# EAGLE design controller (EAGLE 6.3)
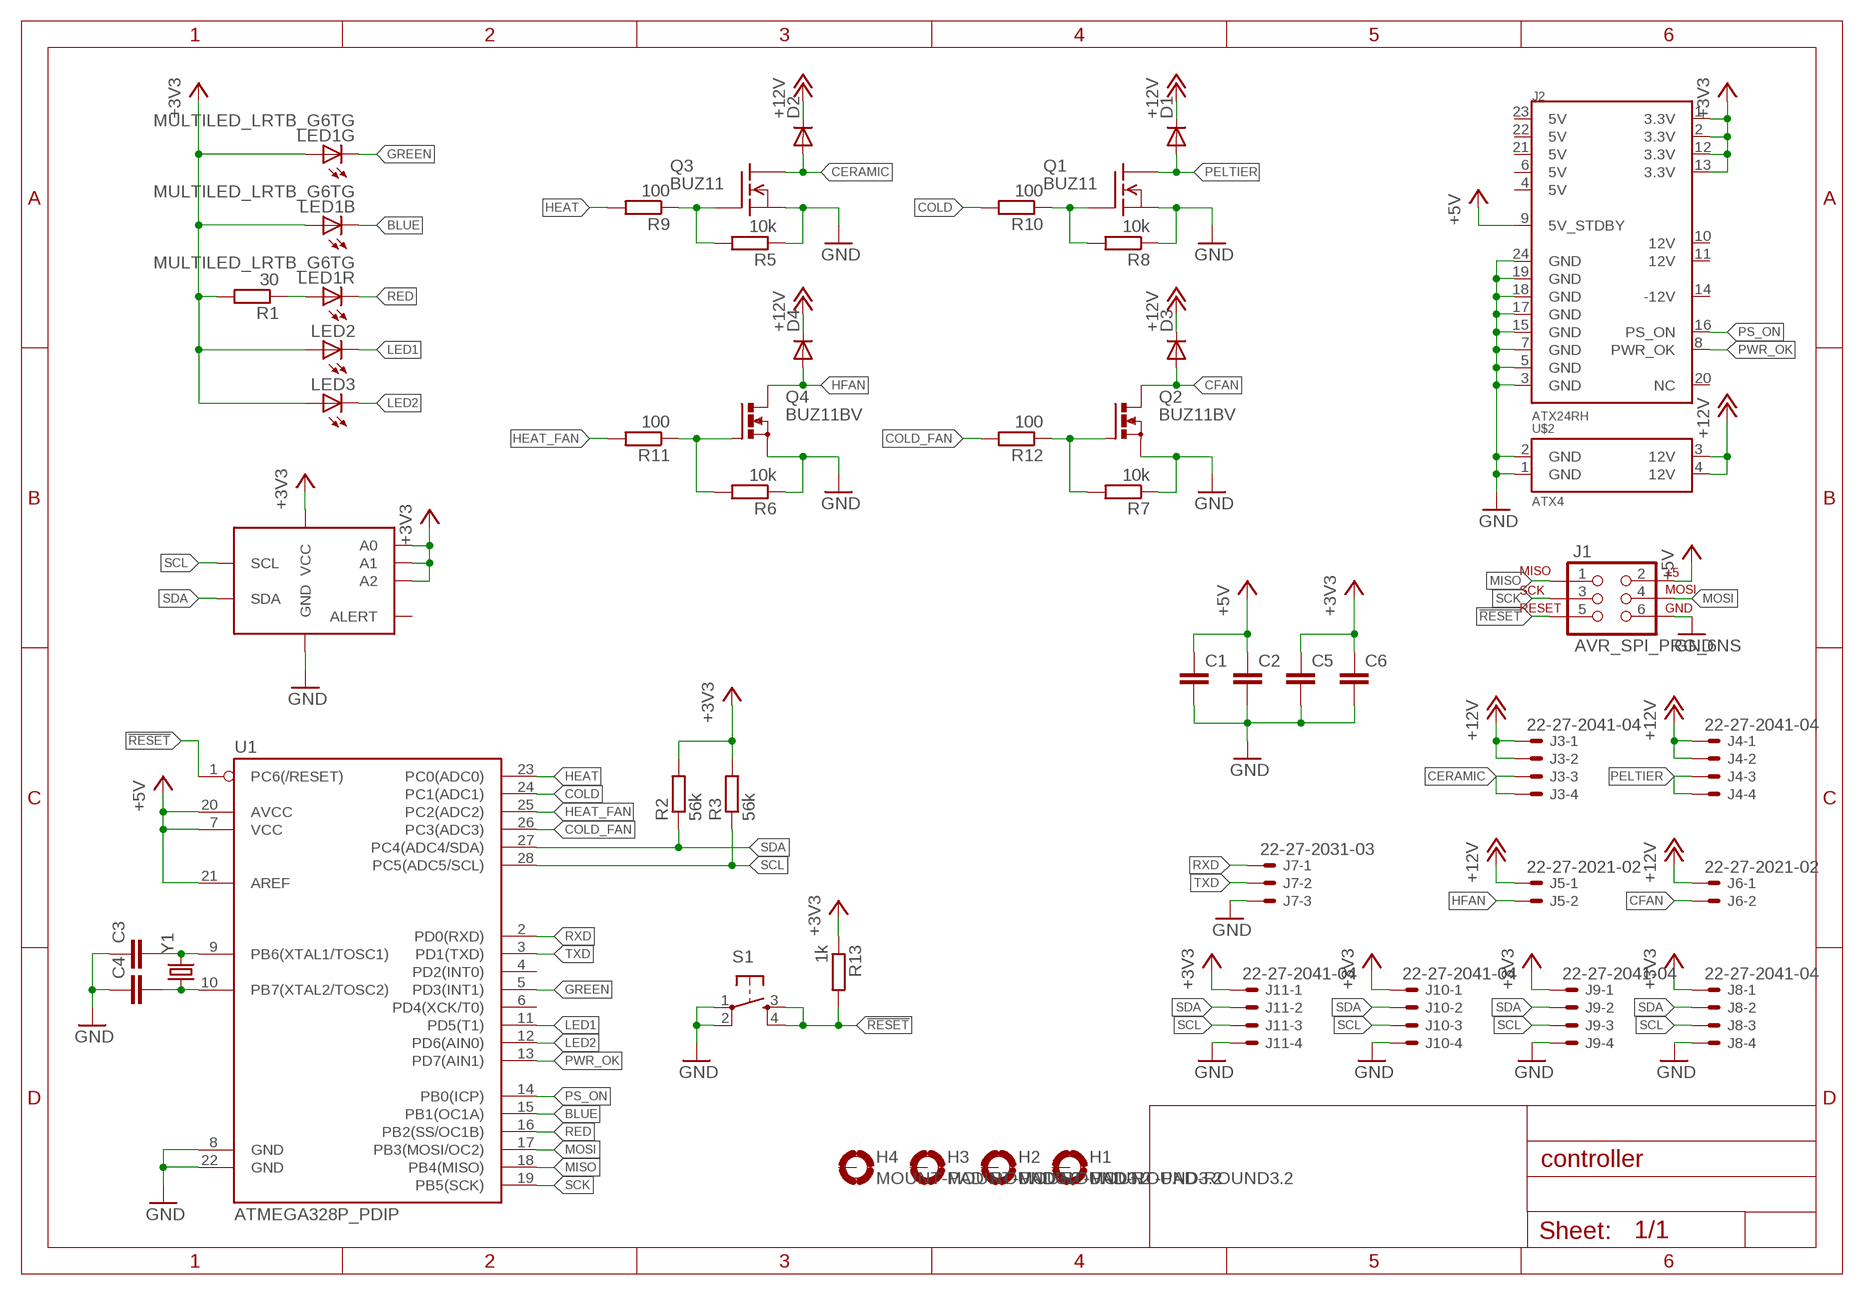
[diagram p0: schematic, sheet 1]

## Parts
C1  C-EUC0603  [C0603]
C2  C-EUC0603  [C0603]
C3  C-EUC0603K  [C0603K]
C4  C-EUC0603K  [C0603K]
C5  C-EUC0603  [C0603]
C6  C-EUC0603  [C0603]
D1  DIODE-DO201-15  [DO201-15]
D2  DIODE-DO201-15  [DO201-15]
D3  DIODE-DO201-15  [DO201-15]
D4  DIODE-DO201-15  [DO201-15]
H1  MOUNT-PAD-ROUND3.2  [3,2-PAD]
H2  MOUNT-PAD-ROUND3.2  [3,2-PAD]
H3  MOUNT-PAD-ROUND3.2  [3,2-PAD]
H4  MOUNT-PAD-ROUND3.2  [3,2-PAD]
J1  AVR_SPI_PRG_6NS  [2X3-NS]
J2  ATX24RH  [ATX24_RIGHT_ANGLE]
J3  22-27-2041-04  [6410-04]
J4  22-27-2041-04  [6410-04]
J5  22-27-2021-02  [6410-02]
J6  22-27-2021-02  [6410-02]
J7  22-27-2031-03  [6410-03]
J8  22-27-2041-04  [6410-04]
J9  22-27-2041-04  [6410-04]
J10  22-27-2041-04  [6410-04]
J11  22-27-2041-04  [6410-04]
LED1  MULTILED_LRTB_G6TG  [P-LCC-6_TOPLED]
LED2  LEDSML1206  [SML1206]
LED3  LEDSML1206  [SML1206]
Q1  BUZ11  [TO220]
Q2  BUZ11BV  [TO220BV]
Q3  BUZ11  [TO220]
Q4  BUZ11BV  [TO220BV]
R1  30  R-EU_R0603  [R0603]
R2  56k  R-EU_R0603  [R0603]
R3  56k  R-EU_R0603  [R0603]
R5  10k  R-EU_R0603  [R0603]
R6  10k  R-EU_R0603  [R0603]
R7  10k  R-EU_R0603  [R0603]
R8  10k  R-EU_R0603  [R0603]
R9  100  R-EU_R0603  [R0603]
R10  100  R-EU_R0603  [R0603]
R11  100  R-EU_R0603  [R0603]
R12  100  R-EU_R0603  [R0603]
R13  1k  R-EU_R0603  [R0603]
S1  TAC_SWITCHPTH  [TACTILE-PTH]
U1  ATMEGA328P_PDIP  [DIL28-3]
U$1  TMP175  [MSOP8]
U$2  ATX4  [ATX4]
Y1  CRYSTALHC49UV  [HC49U-V]

## Nets
!RESET: J1.5 R13.2 S1.3 S1.4 U1.1(PC6(/RESET))
+3V3: C5.1 C6.1 J2.1(3.3V) J2.2(3.3V) J2.12(3.3V) J2.13(3.3V) J8.1 J9.1 J10.1 J11.1 LED1.A2(G:A) LED1.A3(B:A) LED2.A LED3.A R1.2 R2.2 R3.2 R13.1 U$1.5(A2) U$1.6(A1) U$1.7(A0) U$1.8(VCC)
+5V: C1.1 C2.1 J1.2 J2.9(5V_STDBY) U1.7(VCC) U1.20(AVCC) U1.21(AREF)
+12V: D1.C D2.C D3.C D4.C J3.1 J3.2 J4.1 J4.2 J5.1 J6.1 U$2.3(12V) U$2.4(12V)
BLUE: LED1.C3(B:C) U1.15(PB1(OC1A))
CERAMIC: D2.A J3.3 J3.4 Q3.2(D)
CFAN: D3.A J6.2 Q2.D
COLD: R10.2 U1.24(PC1(ADC1))
COLD_FAN: R12.2 U1.26(PC3(ADC3))
GND: C1.2 C2.2 C3.1 C4.1 C5.2 C6.2 J1.6 J2.3(GND) J2.5(GND) J2.7(GND) J2.15(GND) J2.17(GND) J2.18(GND) J2.19(GND) J2.24(GND) J7.3 J8.4 J9.4 J10.4 J11.4 Q1.3(S) Q2.S Q3.3(S) Q4.S R5.1 R6.1 R7.1 R8.1 S1.1 S1.2 U1.8(GND) U1.22(GND) U$1.4(GND) U$2.1(GND) U$2.2(GND)
GREEN: LED1.C2(G:C) U1.5(PD3(INT1))
HEAT: R9.2 U1.23(PC0(ADC0))
HEAT_FAN: R11.2 U1.25(PC2(ADC2))
HFAN: D4.A J5.2 Q4.D
LED1: LED2.C U1.11(PD5(T1))
LED2: LED3.C U1.12(PD6(AIN0))
MISO: J1.1 U1.18(PB4(MISO))
MOSI: J1.4 U1.17(PB3(MOSI/OC2))
N$1: C3.2 U1.9(PB6(XTAL1/TOSC1)) Y1.2
N$2: C4.2 U1.10(PB7(XTAL2/TOSC2)) Y1.1
N$3: LED1.A1(R:A) R1.1
N$4: Q2.G R7.2 R12.1
N$5: Q4.G R6.2 R11.1
N$9: Q1.1(G) R8.2 R10.1
N$10: Q3.1(G) R5.2 R9.1
PELTIER: D1.A J4.3 J4.4 Q1.2(D)
PS_ON: J2.16(PS_ON) U1.14(PB0(ICP))
PWR_OK: J2.8(PWR_OK) U1.13(PD7(AIN1))
RED: LED1.C1(R:C) U1.16(PB2(SS/OC1B))
RXD: J7.1 U1.2(PD0(RXD))
SCK: J1.3 U1.19(PB5(SCK))
SCL: J8.3 J9.3 J10.3 J11.3 R3.1 U1.28(PC5(ADC5/SCL)) U$1.2(SCL)
SDA: J8.2 J9.2 J10.2 J11.2 R2.1 U1.27(PC4(ADC4/SDA)) U$1.1(SDA)
TXD: J7.2 U1.3(PD1(TXD))
Unconnected: H1.B3,2(MOUNT) H2.B3,2(MOUNT) H3.B3,2(MOUNT) H4.B3,2(MOUNT) J2.4(5V) J2.6(5V) J2.10(12V) J2.11(12V) J2.14(-12V) J2.20(NC) J2.21(5V) J2.22(5V) J2.23(5V) U1.4(PD2(INT0)) U1.6(PD4(XCK/T0)) U$1.3(ALERT)

## Library data of the parts
C1-C6 = rcl:C-EU: CAPACITOR, European symbol
D1-D4 = diode:DIODE-: DIODE
H1-H4 = holes:MOUNT-PAD-ROUND: MOUNTING PAD, round
J1 = SparkFun-Connectors:AVR_SPI_PRG_6: AVR ISP 6 Pin This is the reduced ISP connector for AVR programming. Common on Arduino. This footprint will take up less PCB space and can be used with a 10-pin to 6-pin adapter such as SKU: BOB-08508
J2 = hauser:ATX24: ATX24 Pin Power Supply Connector This is a good connector for connecting a computer power supply to a PCB. It's massive, but provides many amps of power at 5V and 12V. SKU: PRT-09498
J3 J4 J8-J11 = con-molex:22-?-04: CONNECTOR wire to board 2.54 mm (.1 inch) pitch header; OC_FARNELL: unknown; OC_NEWARK: unknown
J5 J6 = con-molex:22-?-02: CONNECTOR wire to board 2.54 mm (.1 inch) pitch header; OC_FARNELL: unknown; OC_NEWARK: unknown
J7 = con-molex:22-?-03: CONNECTOR wire to board 2.54 mm (.1 inch) pitch header; OC_FARNELL: unknown; OC_NEWARK: unknown
LED1 = hauser:MULTILED_LRTB_G6TG: 6-lead MULTILED® Enhanced optical Power LED (ThinFilm® / ThinGaN®) Source. OSRAM - LRTB_G6TG.pdf
LED2 LED3 = hauser:LED: LED OSRAM: - CHIPLED LG R971, LG N971, LY N971, LG Q971, LY Q971, LO R971, LY R971 LH N974, LH R974 LS Q976, LO Q976, LY Q976 LO Q996 - Hyper CHIPLED LW Q18S LB Q993, LB Q99A, LB R99A - SideLED LS A670, LO A670, LY A670, LG A670, LP A670 LB A673, LV A673, LT A673, LW A673 LH A674 LY A675 LS A676, LA A676, LO A676, LY A676, LW A676 LS A679, LY A679, LG A679 - Hyper Micro SIDELED® LS Y876, LA Y876, LO Y876, LY Y876 LT Y87S - SmartLED LW L88C, LW L88S LB L89C, LB L89S, LG L890 LS L89K, LO L89K, LY L89K LS L896, LA L896, LO L896, LY L896 - TOPLED LS T670, LO T670, LY T670, LG T670, LP T670 LSG T670, LSP T670, LSY T670, LOP T670, LYG T670 LG T671, LOG T671, LSG T671 LB T673, LV T673, LT T673, LW T673 LH T674 LS T676, LA T676, LO T676, LY T676, LB T676, LH T676, LSB T676, LW T676 LB T67C, LV T67C, LT T67C, LS T67K, LO T67K, LY T67K, LW E67C LS E67B, LA E67B, LO E67B, LY E67B, LB E67C, LV E67C, LT E67C LW T67C LS T679, LY T679, LG T679 LS T770, LO T770, LY T770, LG T770, LP T770 LB T773, LV T773, LT T773, LW T773 LH T774 LS E675, LA E675, LY E675, LS T675 LS T776, LA T776, LO T776, LY T776, LB T776 LHGB T686 LT T68C, LB T68C - Hyper Mini TOPLED® LB M676 - Mini TOPLED Santana® LG M470 LS M47K, LO M47K, LY M47K Source: http://www.osram.convergy.de LUXEON: - LUMILED® LXK2-PW12-R00, LXK2-PW12-S00, LXK2-PW14-U00, LXK2-PW14-V00 LXK2-PM12-R00, LXK2-PM12-S00, LXK2-PM14-U00 LXK2-PE12-Q00, LXK2-PE12-R00, LXK2-PE12-S00, LXK2-PE14-T00, LXK2-PE14-U00 LXK2-PB12-K00, LXK2-PB12-L00, LXK2-PB12-M00, LXK2-PB14-N00, LXK2-PB14-P00, LXK2-PB14-Q00 LXK2-PR12-L00, LXK2-PR12-M00, LXK2-PR14-Q00, LXK2-PR14-R00 LXK2-PD12-Q00, LXK2-PD12-R00, LXK2-PD12-S00 LXK2-PH12-R00, LXK2-PH12-S00 LXK2-PL12-P00, LXK2-PL12-Q00, LXK2-PL12-R00 Source: www.luxeon.com KINGBRIGHT: KA-3528ASYC Source: www.kingbright.com
Q1 Q3 = transistor-fet:BUZ11: N-Channel Enhancement MOSFET 50V; 30A; 0,040Ohm
Q2 Q4 = transistor-power:BUZ11: N-CHANNEL MOS FET
R1-R3 R5-R13 = rcl:R-EU_: RESISTOR, European symbol
S1 = SparkFun-Electromechanical:TAC_SWITCH: Momentary Switch Button commonly used for reset or general input. Spark Fun Electronics SKU : COM-00097 SMT- SWCH-08247
U1 = SparkFun-DigitalIC:ATMEGA328P_PDIP: uC used in the Arduino 32kb flash, 1k EEPROM, 2k SRAM This is the through-hole version of this chip.
U$1 = hauser:TMP175
U$2 = hauser:ATX4
Y1 = SparkFun-FreqCtrl:CRYSTAL: Various standard crystals. Proven footprints. Spark Fun Electronics SKU : COM-00534

## Board
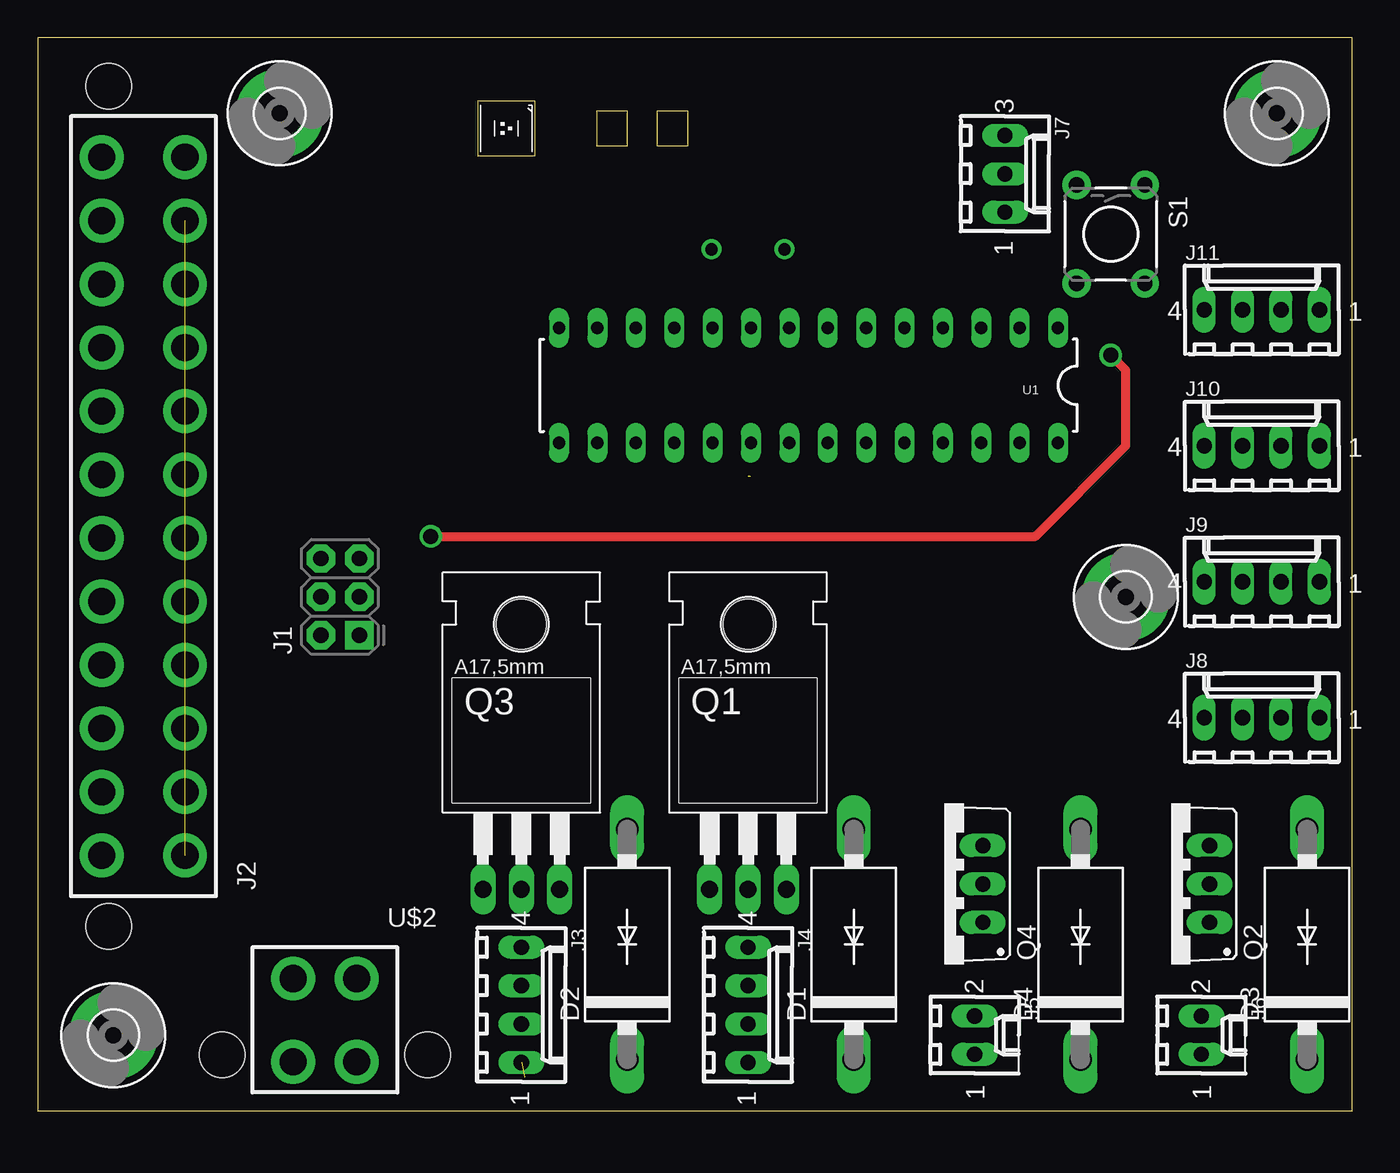
[diagram p1: board, top side]
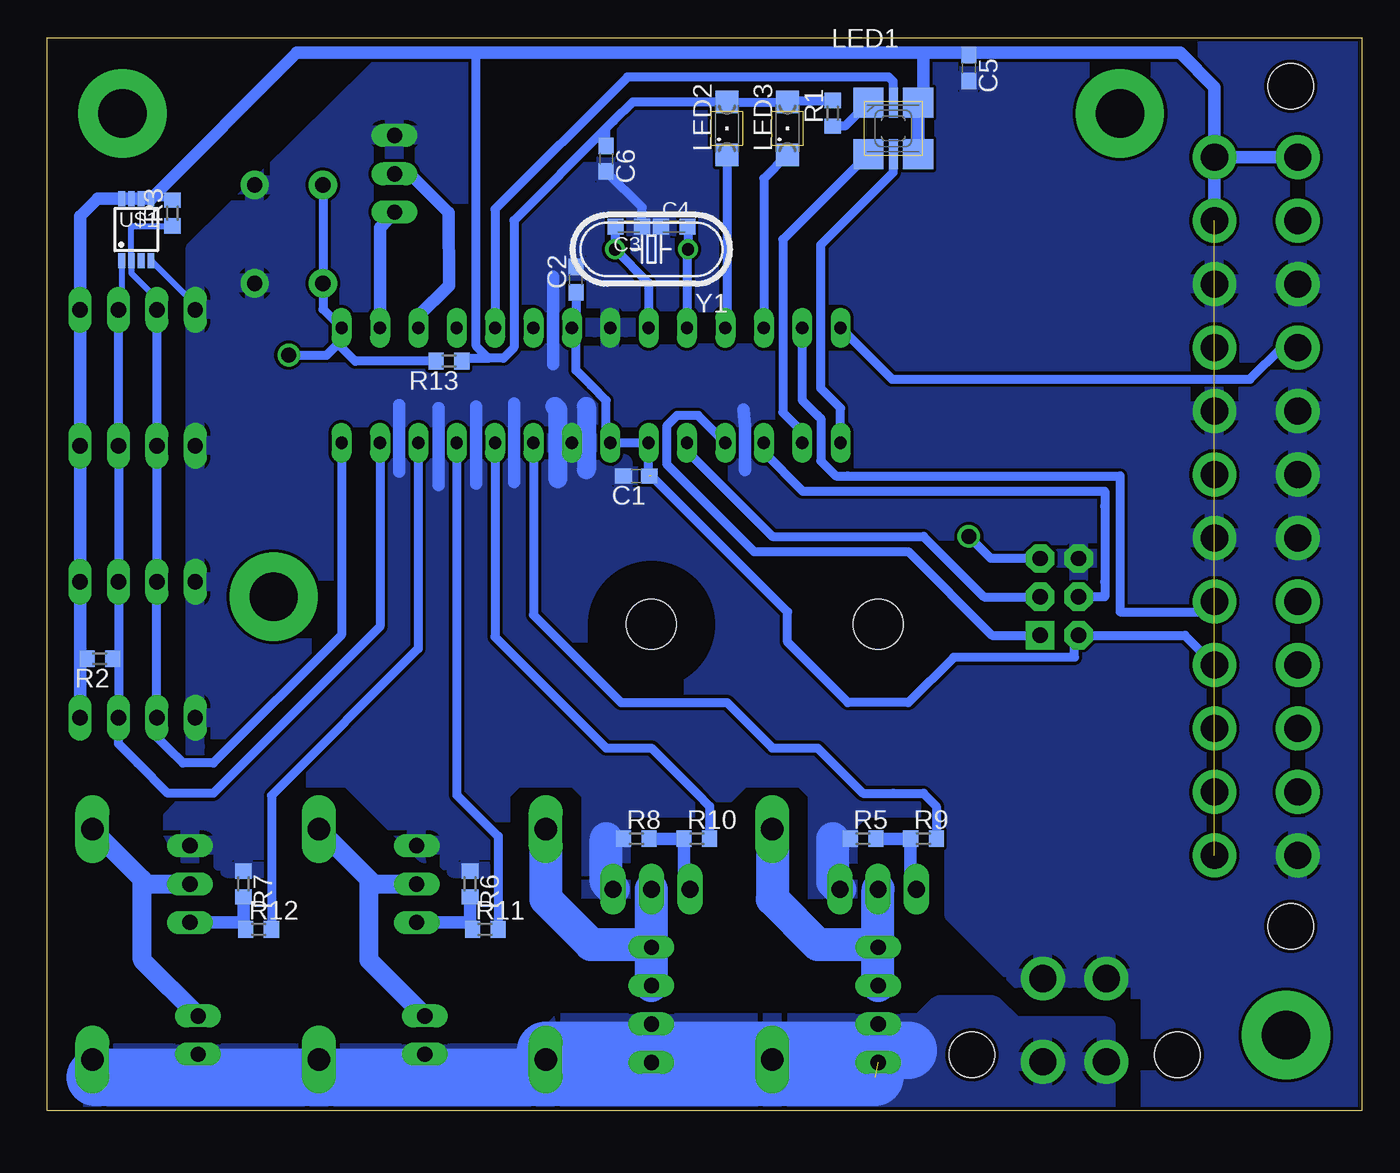
[diagram p2: board, bottom side, seen from below]

Size 87 x 71 mm. Coordinates in mm from the lower left corner, seen from the top.
Outline: 0,0 87,0 87,71 0,71 0,0
Copper layers (1*16): Top 0.035mm / dielectric 1.5mm / Bottom 0.035mm
Design rules "default *": minimum track width 10mil, minimum drill 24mil, track to track 8mil, track to pad 8mil, pad to pad 8mil, via to via 8mil, smd to smd 8mil, copper to edge 10mil, drill to drill 8mil, minimum pad ring 10mil, minimum via ring 8mil, stop-mask expansion 4mil, vias tented up to drill 0mil, thermal gap 10mil

### Footprints (pad centres in the part's own frame; a part is rotated, then mirrored left to right if it is on the bottom)
C0603 = smd 1.1 x 1: 1 -0.85,0; 2 0.85,0
C0603K = smd 1.05 x 1.08: 1 -0.875,0; 2 0.875,0
DO201-15 = drill 1.499 long: A 7.62,0; C -7.62,0
3,2-PAD = drill 3.2 pad 5.842: B3,2 0,0
2X3-NS = drill 1.016 pad 1.88 square: 1 -2.54,-1.27 | drill 1.016 pad 1.88 octagon: 2 -2.54,1.27; 3 0,-1.27; 4 0,1.27; 5 2.54,-1.27; 6 2.54,1.27
ATX24_RIGHT_ANGLE = drill 1.8 pad 2.9: 1 23.1,-2.74; 2 18.9,-2.74; 3 14.7,-2.74; 4 10.5,-2.74; 5 6.3,-2.74; 6 2.1,-2.74; 7 -2.1,-2.74; 8 -6.3,-2.74; 9 -10.5,-2.74; 10 -14.7,-2.74; 11 -18.9,-2.74; 12 -23.1,-2.74; 13 23.1,2.76; 14 18.9,2.76; 15 14.7,2.76; 16 10.5,2.76; 17 6.3,2.76; 18 2.1,2.76; 19 -2.1,2.76; 20 -6.3,2.76; 21 -10.5,2.76; 22 -14.7,2.76; 23 -18.9,2.76; 24 -23.1,2.76 | hole 3: -27.8,2.3; 27.8,2.3
6410-04 = drill 1.016 long: 1 3.81,0; 2 1.27,0; 3 -1.27,0; 4 -3.81,0
6410-02 = drill 1.016 long: 1 1.27,0; 2 -1.27,0
6410-03 = drill 1.016 long: 1 2.54,0; 2 0,0; 3 -2.54,0
P-LCC-6_TOPLED = smd 2 x 2: A1 -1.65,1.7; A2 1.65,1.7; A3 1.65,-1.7; C1 -1.65,-1.7 | smd 0.6 x 2: C2 0,1.7; C3 0,-1.7
SML1206 = smd 1.5 x 1.5: A 1.75,0; C -1.75,0
TO220 = drill 1.118 long: 1 -2.54,-6.35; 2 0,-6.35; 3 2.54,-6.35 | hole 3.302: 0,11.176
TO220BV = drill 1.016 long: D 0,-2.54; G -2.54,-2.54; S 2.54,-2.54
R0603 = smd 1 x 1.1: 1 -0.85,0; 2 0.85,0
TACTILE-PTH = drill 1.016 pad 1.88: 1 -3.251,2.261; 2 3.251,2.261; 3 -3.251,-2.261; 4 3.251,-2.261
DIL28-3 = drill 0.813 long: 1 -16.51,-3.81; 2 -13.97,-3.81; 3 -11.43,-3.81; 4 -8.89,-3.81; 5 -6.35,-3.81; 6 -3.81,-3.81; 7 -1.27,-3.81; 8 1.27,-3.81; 9 3.81,-3.81; 10 6.35,-3.81; 11 8.89,-3.81; 12 11.43,-3.81; 13 13.97,-3.81; 14 16.51,-3.81; 15 16.51,3.81; 16 13.97,3.81; 17 11.43,3.81; 18 8.89,3.81; 19 6.35,3.81; 20 3.81,3.81; 21 1.27,3.81; 22 -1.27,3.81; 23 -3.81,3.81; 24 -6.35,3.81; 25 -8.89,3.81; 26 -11.43,3.81; 27 -13.97,3.81; 28 -16.51,3.81
MSOP8 = smd 0.45 x 1: 1 -0.975,-2.05; 2 -0.325,-2.05; 3 0.325,-2.05; 4 0.975,-2.05; 5 0.975,2.05; 6 0.325,2.05; 7 -0.325,2.05; 8 -0.975,2.05
ATX4 = drill 1.8 pad 2.9: 1 2.1,-2.74; 2 -2.1,-2.74; 3 2.1,2.76; 4 -2.1,2.76 | hole 3: -6.8,2.3; 6.8,2.3
HC49U-V = drill 0.813: 1 -2.413,0; 2 2.413,0

### Placement (x,y rotation side)
C1  48,42 180 bottom
C2  52,55 90 bottom
C3  48.5,58.5 180 bottom
C4  45.5,58.5 0 bottom
C5  26,69 270 bottom
C6  50,63 270 bottom
D1  54,11 90 top
D2  39,11 90 top
D3  84,11 90 top
D4  69,11 90 top
H1  5,5 0 top
H2  72,34 0 top
H3  82,66 0 top
H4  16,66 0 top
J1  20,34 90 top
J2  7,40 90 top
J3  32,7 270 top
J4  47,7 270 top
J5  62,5 270 top
J6  77,5 270 top
J7  64,62 270 top
J8  81,26 0 top
J9  81,35 0 top
J10  81,44 0 top
J11  81,53 0 top
LED1  31,65 0 bottom
LED2  42,65 90 bottom
LED3  38,65 90 bottom
Q1  47,21 0 top
Q2  75,15 90 top
Q3  32,21 0 top
Q4  60,15 90 top
R1  35,66 90 bottom
R2  83.5,29.9 180 bottom
R3  78.7,59.4 90 bottom
R5  33,18 0 bottom
R6  59,15 270 bottom
R7  74,15 270 bottom
R8  48,18 0 bottom
R9  29,18 0 bottom
R10  44,18 0 bottom
R11  58,12 0 bottom
R12  73,12 0 bottom
R13  60.4,49.6 180 bottom
S1  71,58 270 top
U1  51,48 180 top
U$1  81.09,58.31 0 bottom
U$2  19,6 180 top
Y1  47,57 180 bottom

### Tracks (layer width: path | path; a pad name or v marks a point on that pad's centre or on a via)
!RESET  (via drill 1 pad 1.27)
  Top 0.61: v26,38 66,38 72,44 72,49 v71,50
  Bottom 0.61: R13.2 66.6,49.6 67.51,50.51 67.51,51 | J1.5 24.54,36.54 v26,38 | v71,50 69.32,50 68.51,50 67.51,51 | S1.3 S1.4 68.74,53.04 U1.1 67.51,51
+3V3  (1 unrouted)
  Bottom 0.406: R3.2 79.1,60.36 U$1.5
  Bottom 0.61: R2.2 84.45,30 84.81,30 | R1.2 37.9,66.85 LED3.A LED2.A 48.25,66.75 49.5,65.5 | 49.5,65.5 50,65 | 50,65 56.1,58.9 56.1,50.5 56.8,49.8 57.8,49.8 | 57.8,49.8 58.6,50.6 58.6,70 | C6.1 50,65 | 50,65 49.5,65.5 | C5.1 26,70 | R13.1 59.55,49.8 57.8,49.8
  Bottom 0.813: J10.1 J9.1 84.81,30 J8.1 | J2.13 J2.1 | J2.1 J2.2 | J10.1 | J10.1 J11.1 84.81,59.19 83.64,60.36 U$1.8 U$1.7 U$1.6 U$1.5 70.47,70 58.6,70 29,70 | J2.1 9.74,67.74 12,70 26,70 26.05,70 29,70 | LED1.A3 LED1.A2 29,67.05 29,70
+5V  (1 unrouted)
  Bottom 0.61: C2.1 52,52.08 U1.7 52,51.54 52,49 51,48 50,47 50,44.46 U1.21 U1.20 47.19,42.19 47,42 38,33 38,31 34,27 30,27 27,30 19,30 19,31.19 J1.2 11.7,31.46 J2.9
+12V  (1 unrouted)
  Bottom 3.81: 32.2,2.2 83.8,2.2 | 30,4 54,4 54,3
  pour Bottom: 16.9,5.6 23,5.6 24.4,7 28,7 29.2,5.8 53,5.8 55,3.8 84,3.8 84,0 16.9,0
BLUE
  Bottom 0.61: U1.15 34.49,46.49 35.8,47.8 35.8,57.3 31,62.1 LED1.C3
CERAMIC
  Bottom 2.184: D2.A 39,14 36,11 32.19,11 J3.4 | J3.3 J3.4 | J3.4 Q3.2
CFAN
  Bottom 1.27: D3.A 80.69,15.31 | 80.69,15.31 80.38,15 Q2.D | J6.2 80.69,9.96 80.69,15.31
COLD
  Bottom 0.61: U1.24 57.35,31.35 50,24 47,24 44,21 43.15,20.15 R10.2
COLD_FAN
  Bottom 0.61: U1.26 62.43,30.57 72,21 72.15,20.85 R12.2
GND
  Bottom 0.406: U$1.4 77.19,53.34 J11.4
  Bottom 0.61: C3.1 47.62,59.77 C6.2
  Bottom 0.813: 56.1,41.6 56.1,46.8 | 58.6,41.5 58.6,46.6 | 61.1,41.4 61.1,46.5 | 63.7,42.3 63.7,46.7 | 53.5,55.2 53.5,49.4 | 40.9,46.4 40.8,45.3 40.8,42.4
  Bottom 1.27: 51.3,46.6 51.3,42.4 | 53.4,46.6 53.2,46.4 53.2,41.8
  Bottom 2.184: Q1.3 50,15.11 50,18 | Q3.3 35,15.11 35,18
  pour Bottom: 0,0 14,0 14,8 22,8 27,13 27,20 33,20 34,19 34,14 36,14 36,21 37,22 41,22 43,20 49,20 49,14 51,14 51,21 52,22 56,22 57,21 57,17 58,16 60,16 61,17 62,17 67,22 71,22 72,21 72,16 75,16 76,17 78,17 79,19 77.2,21 77.2,57 63,71 0,71
GREEN
  Bottom 0.61: LED1.C2 31,68.1 31.3,68.4 48.6,68.4 57.35,59.65 U1.5
HEAT
  Bottom 0.61: U1.23 54.81,32.81 49,27 42,27 39,24 36,24 33,21 31,21 29,21 28.15,20.15 R9.2
HEAT_FAN
  Bottom 0.61: U1.25 59.89,20.89 58,19 57.15,18.15 R11.2
HFAN
  Bottom 1.27: D4.A 65.69,15.31 | 65.69,15.31 65.38,15 Q4.D | J5.2 65.69,9.96 65.69,15.31
LED1
  Bottom 0.61: LED2.C 42,62 42,61 42,59 42,52 42.11,51.89 U1.11
LED2
  Bottom 0.61: LED3.C 39.57,61.68 U1.12
MISO
  Bottom 0.61: U1.18 43.92,46 44,46 45,46 45.1,46 45.3,46 46,45.3 46,42.8 40.2,37 30,37 24.46,31.46 J1.1
MOSI
  Bottom 0.61: U1.17 39.57,43.57 37,41 17,41 17,40 17,35 17,34 J1.4
N$1
  Bottom 0.61: U1.9 47.19,54.78 Y1.2 49.38,57.04 C3.2
N$2
  Bottom 0.61: U1.10 44.65,56.94 Y1.1 44.59,58.46 C4.2
N$3
  Bottom 0.61: LED1.A1 34.2,65.15 R1.1
N$4
  Bottom 0.813: Q2.G 74,12.46 | 74,12.46 R12.1 | R7.2 74,12.46
N$5
  Bottom 0.813: Q4.G 59,12.46 | 59,12.46 R11.1 | R6.2 59,12.46
N$9
  Bottom 0.813: Q1.1 44.85,14.65 R10.1 R8.2
N$10
  Bottom 0.813: R5.2 R9.1 29.85,14.65 Q3.1
PELTIER
  Bottom 1.93: 47.19,11 J4.4
  Bottom 2.184: D1.A 54,14 51,11 47.19,11 | J4.3 J4.4 Q1.2
PS_ON
  Bottom 0.61: U1.14 31.08,48.4 7.4,48.4 5.3,50.5 J2.16
PWR_OK
  Bottom 0.61: U1.13 37.03,47.03 36,46 35.8,45.8 35.8,43 34.8,42 34,42 16,42 16,33 10.44,33 J2.8
RED
  Bottom 0.61: LED1.C1 38.3,57.65 38.3,46.2 37.03,44.93 U1.16
RXD
  Bottom 0.813: U1.2 64.97,58.43 J7.1
SCK
  Bottom 0.61: U1.19 44.65,43.65 41,40 39,38 29,38 26,35 25,34 J1.3
SCL
  Bottom 0.406: R3.1 81.42,58.55 U$1.2 81.42,55.41 80,54 79.73,53.73 J11.3
  Bottom 0.61: J11.3 J10.3 J9.3 J8.3 79.73,24.73 79,24 78,23 76,23 67.51,31.49 U1.28
SDA
  Bottom 0.406: U$1.1 82.06,53.8 J11.2
  Bottom 0.61: 82.27,30 J9.2 J10.2 J11.2 | 82.27,30 J8.2 82.27,24.27 81,23 79,21 76,21 64.97,32.03 U1.27 | R2.1 82.37,29.9 82.27,30
TXD
  Bottom 0.813: U1.3 62.43,52.57 60.4,54.6 60.43,59.43 63,62 J7.2